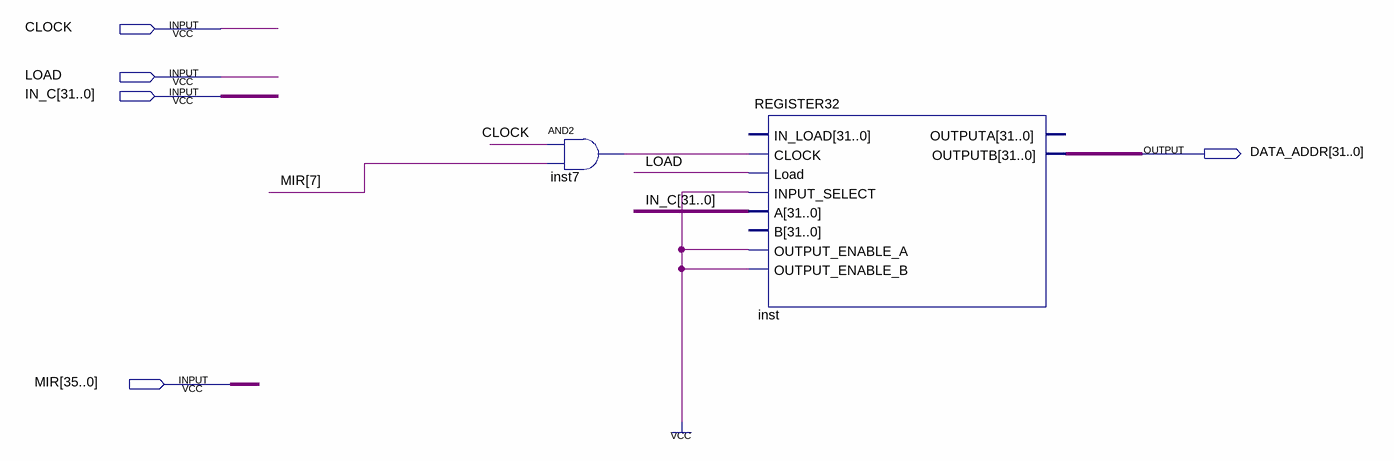
[diagram p0: schematic sheet]
// Quartus schematic MAR.bdf as structural Verilog: 2 symbols, 5 pins
module MAR (
  input  CLOCK,
  input  LOAD,
  input  [31:0] IN_C,
  input  [35:0] MIR,
  output [31:0] DATA_ADDR
);

  wire inst7_out;

  and inst7 (inst7_out, CLOCK, MIR[7]);
  REGISTER32 inst (
    .CLOCK(inst7_out), .Load(LOAD), .INPUT_SELECT(1'b1), .A(IN_C), .OUTPUT_ENABLE_A(1'b1),
    .OUTPUT_ENABLE_B(1'b1), .OUTPUTB(DATA_ADDR));  // open: IN_LOAD, B, OUTPUTA
endmodule
